# Altium schematic sheet ESC.SchDoc
size A; DocumentNumber: 1; SheetNumber: 1; SheetTotal: 6
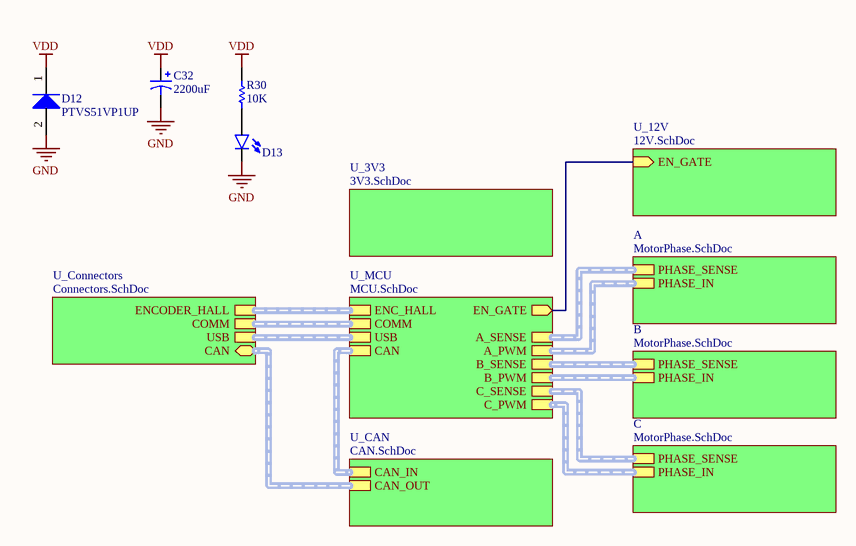
[diagram p0: ESC.SchDoc]

## Parts
C32  value 2200uF  [CAP-RADIAL-HORZ [18x35.5]]  (hidden comment: CAP 2200uF)
D12  PTVS51VP1UP  [SOD-128]
D13  LED-BLUE  [LED0603]  (value not drawn)
R30  value 10K  [R0603[1608]]  (hidden comment: 10K 1% 0603)

## Sub-sheets
A = MotorPhase.SchDoc: PHASE_SENSE (harness Phase Sense), PHASE_IN (harness Phase Input)
B = MotorPhase.SchDoc: PHASE_SENSE (harness Phase Sense), PHASE_IN (harness Phase Input)
C = MotorPhase.SchDoc: PHASE_SENSE (harness Phase Sense), PHASE_IN (harness Phase Input)
U_3V3 = 3V3.SchDoc: no entries
U_12V = 12V.SchDoc: EN_GATE (in)
U_CAN = CAN.SchDoc: CAN_IN (harness CAN Input), CAN_OUT (harness CAN Output)
U_Connectors = Connectors.SchDoc: USB (harness USB), ENCODER_HALL (harness Encoder/Hall), COMM (harness Comm), CAN
U_MCU = MCU.SchDoc: EN_GATE (out), A_SENSE (harness Phase Sense), A_PWM (harness Phase Input), ENC_HALL (harness Encoder/Hall), COMM (harness Comm), CAN (harness CAN Input), USB (harness USB), B_SENSE (harness Phase Sense), B_PWM (harness Phase Input), C_SENSE (harness Phase Sense), C_PWM (harness Phase Input)

## Nets
GND: C32.2 D12.2(A) D13.C
VDD: C32.1 D12.1(K) R30.2
NetD13_A: D13.A R30.1
(unnamed): sheet U_12V/EN_GATE, sheet U_MCU/EN_GATE

## Buses and harness runs
harness sheet A/PHASE_IN = sheet U_MCU/A_PWM
harness sheet A/PHASE_SENSE = sheet U_MCU/A_SENSE
harness sheet B/PHASE_IN = sheet U_MCU/B_PWM
harness sheet B/PHASE_SENSE = sheet U_MCU/B_SENSE
harness sheet C/PHASE_IN = sheet U_MCU/C_PWM
harness sheet C/PHASE_SENSE = sheet U_MCU/C_SENSE
harness sheet U_CAN/CAN_IN = sheet U_MCU/CAN
harness sheet U_CAN/CAN_OUT = sheet U_Connectors/CAN
harness sheet U_Connectors/COMM = sheet U_MCU/COMM
harness sheet U_Connectors/ENCODER_HALL = sheet U_MCU/ENC_HALL
harness sheet U_Connectors/USB = sheet U_MCU/USB

## Library data of the parts
C32 = CAP 2200uF: PartNumber: UVR1J222MHD; Manufacturer: Nichicon; Voltage: 63V; Tolerance: 20%; PackageReference: Radial Capacitor,18x35.5mm; PackageDescription: Radial Capacitor,18x35.5mm, Lead Spacing 7.5mm; Mounting Technology: Through Hole
D12 = PTVS51VP1UP,115: Manufacturer: NXP; PartNumber: PTVS51VP1UP,115; PackageReference: SOD-128; PackageDescription: SOD128, 2-Leads; Mounting Technology: Surface Mount
D13 = LED_0603_BLUE_5mA: PartNumber: LTST-C193TBKT-5A; Manufacturer: Lite-On Inc.; PackageReference: 0603; PackageDescription: 0603 (1608 Metric); Mounting Technology: Surface Mount
R30 = RES_10K_0603_1%: 10K 0.25W 1% 0603 (1005 Metric); Manufacturer: Vishay; PartNumber: RCS060310K0FKEA; Tolerance: 1%; Power: 0.25W; Mounting Technology: Surface Mount; PackageReference: 0603; PackageDescription: 0603 (1608 Metric); ComponentLink1Description: Datasheet; ComponentLink1URL: http://www.vishay.com/docs/20065/rcse3.pdf